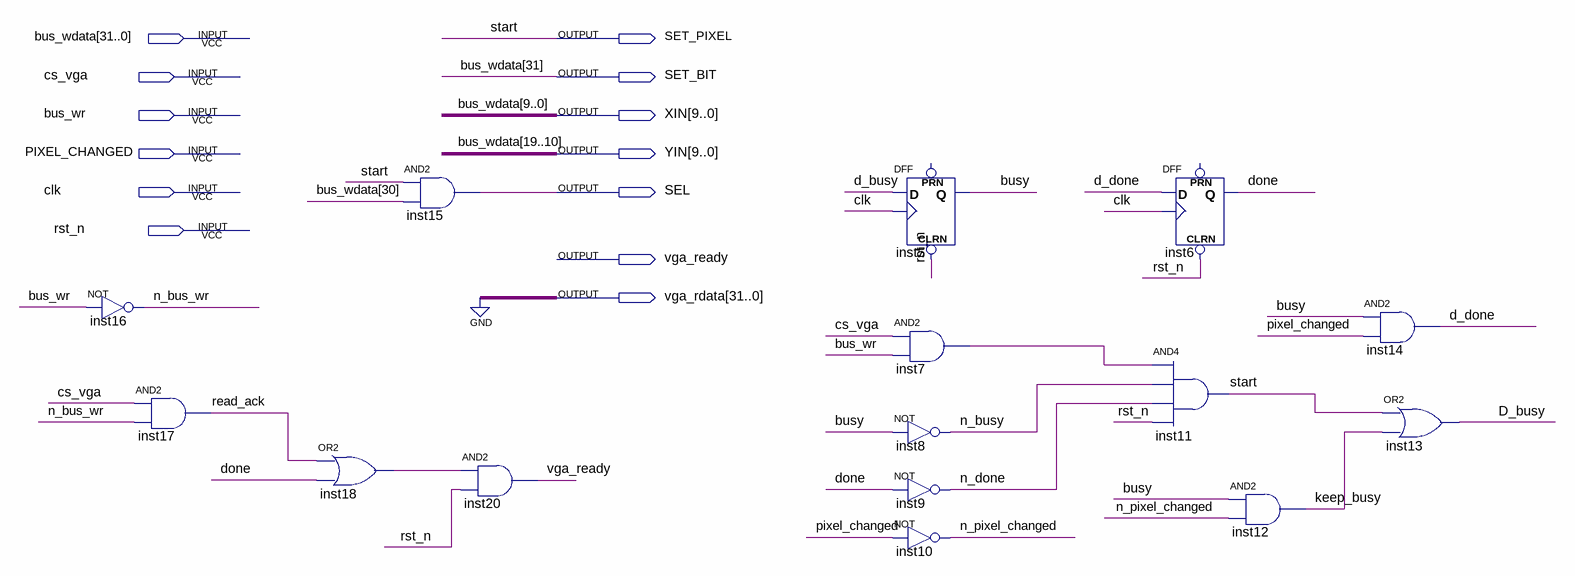
[diagram p0: schematic sheet]
// Quartus schematic VgaBusInterface.bdf as structural Verilog: 15 symbols, 13 pins
module VgaBusInterface (
  input  [31:0] bus_wdata,
  input  cs_vga,
  input  bus_wr,
  input  PIXEL_CHANGED,
  input  clk,
  input  rst_n,
  output SET_PIXEL,
  output SET_BIT,
  output [9:0] XIN,
  output [9:0] YIN,
  output SEL,
  output vga_ready,
  output [31:0] vga_rdata
);

  wire busy, D_busy, d_done, done, inst7_out, inst18_out, keep_busy, n_bus_wr, n_busy, n_done,
       n_pixel_changed, read_ack;

  not inst16 (n_bus_wr, bus_wr);
  and inst17 (read_ack, cs_vga, n_bus_wr);
  or inst18 (inst18_out, read_ack, done);
  and inst15 (SEL, SET_PIXEL, bus_wdata[30]);
  and inst20 (vga_ready, inst18_out, rst_n);
  DFF inst5 (.CLRN(rst_n), .CLK(clk), .D(D_busy), .Q(busy));  // open: PRN
  and inst7 (inst7_out, cs_vga, bus_wr);
  not inst8 (n_busy, busy);
  not inst9 (n_done, done);
  not inst10 (n_pixel_changed, PIXEL_CHANGED);
  DFF inst6 (.CLRN(rst_n), .CLK(clk), .D(d_done), .Q(done));  // open: PRN
  and inst11 (SET_PIXEL, inst7_out, n_busy, n_done, rst_n);
  and inst12 (keep_busy, busy, n_pixel_changed);
  and inst14 (d_done, busy, PIXEL_CHANGED);
  or inst13 (D_busy, SET_PIXEL, keep_busy);

  assign SET_BIT = bus_wdata[31];
  assign vga_rdata = {32{1'b0}};
  assign XIN = bus_wdata[9:0];
  assign YIN = bus_wdata[19:10];

  // Other names for the same wires on the sheet: start = SET_PIXEL
endmodule
